# EAGLE schematic mainboard_matrix (EAGLE 9.0.1)
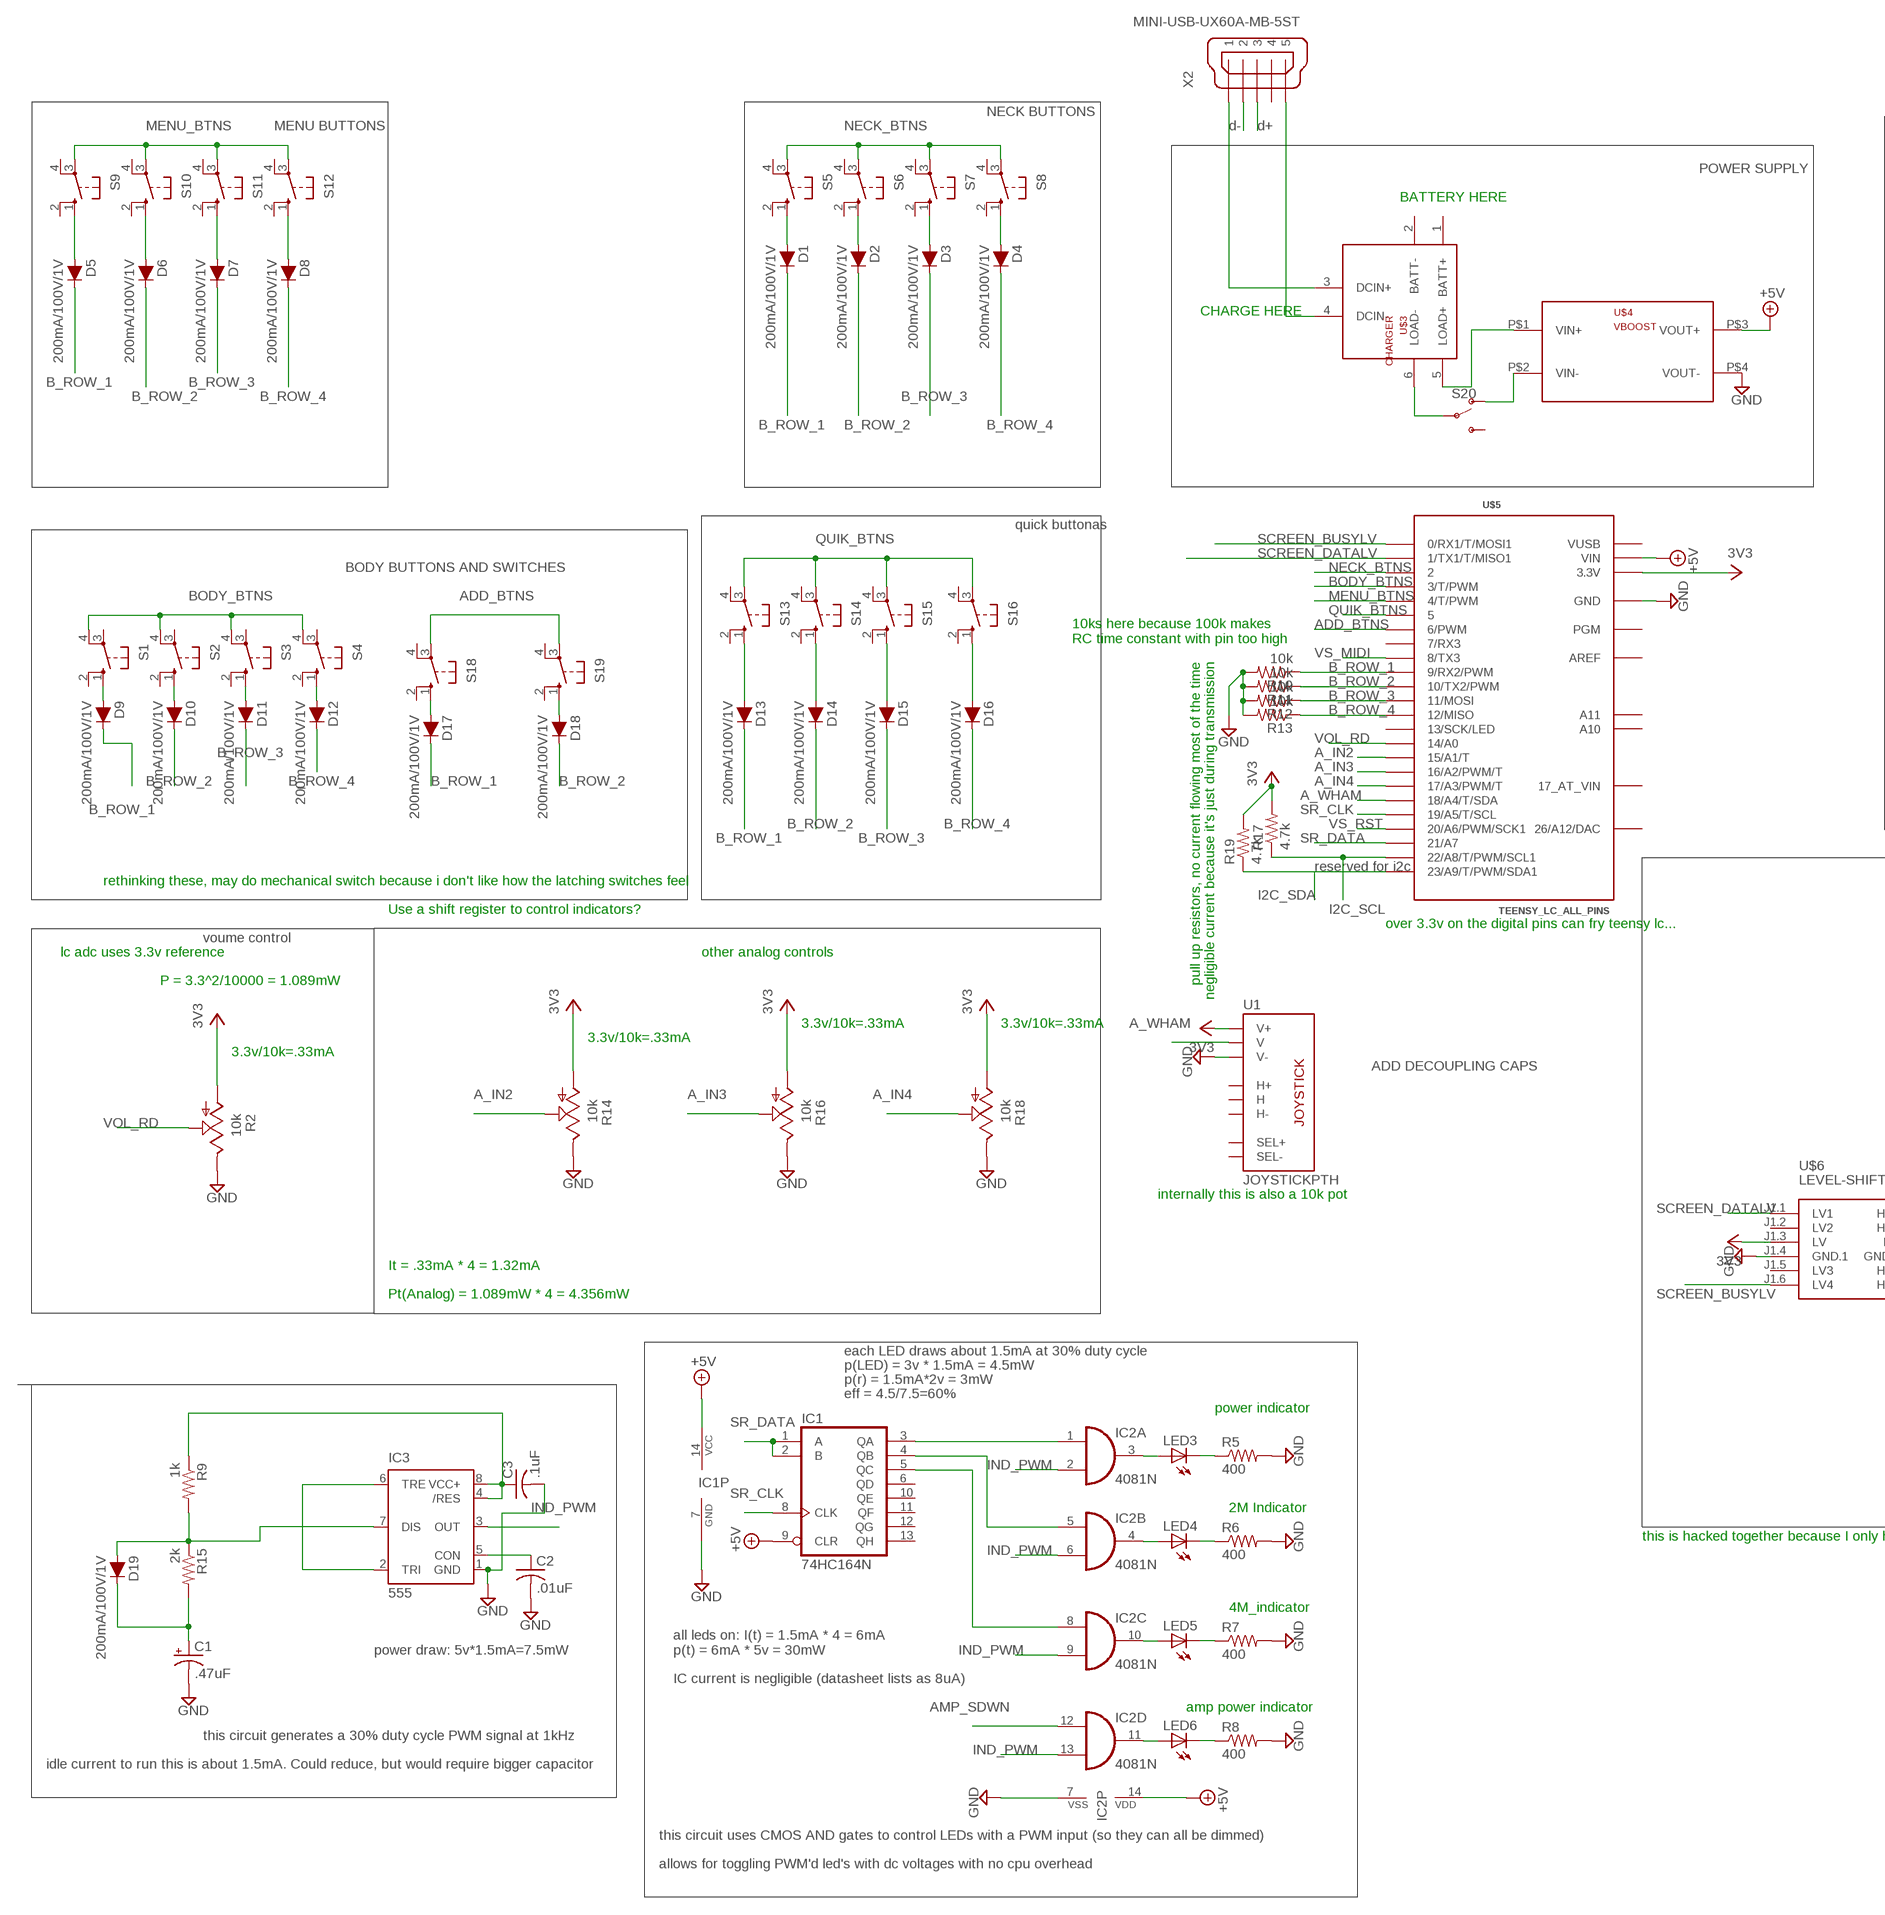
[diagram p0: schematic, sheet 1, part 1 of 2]
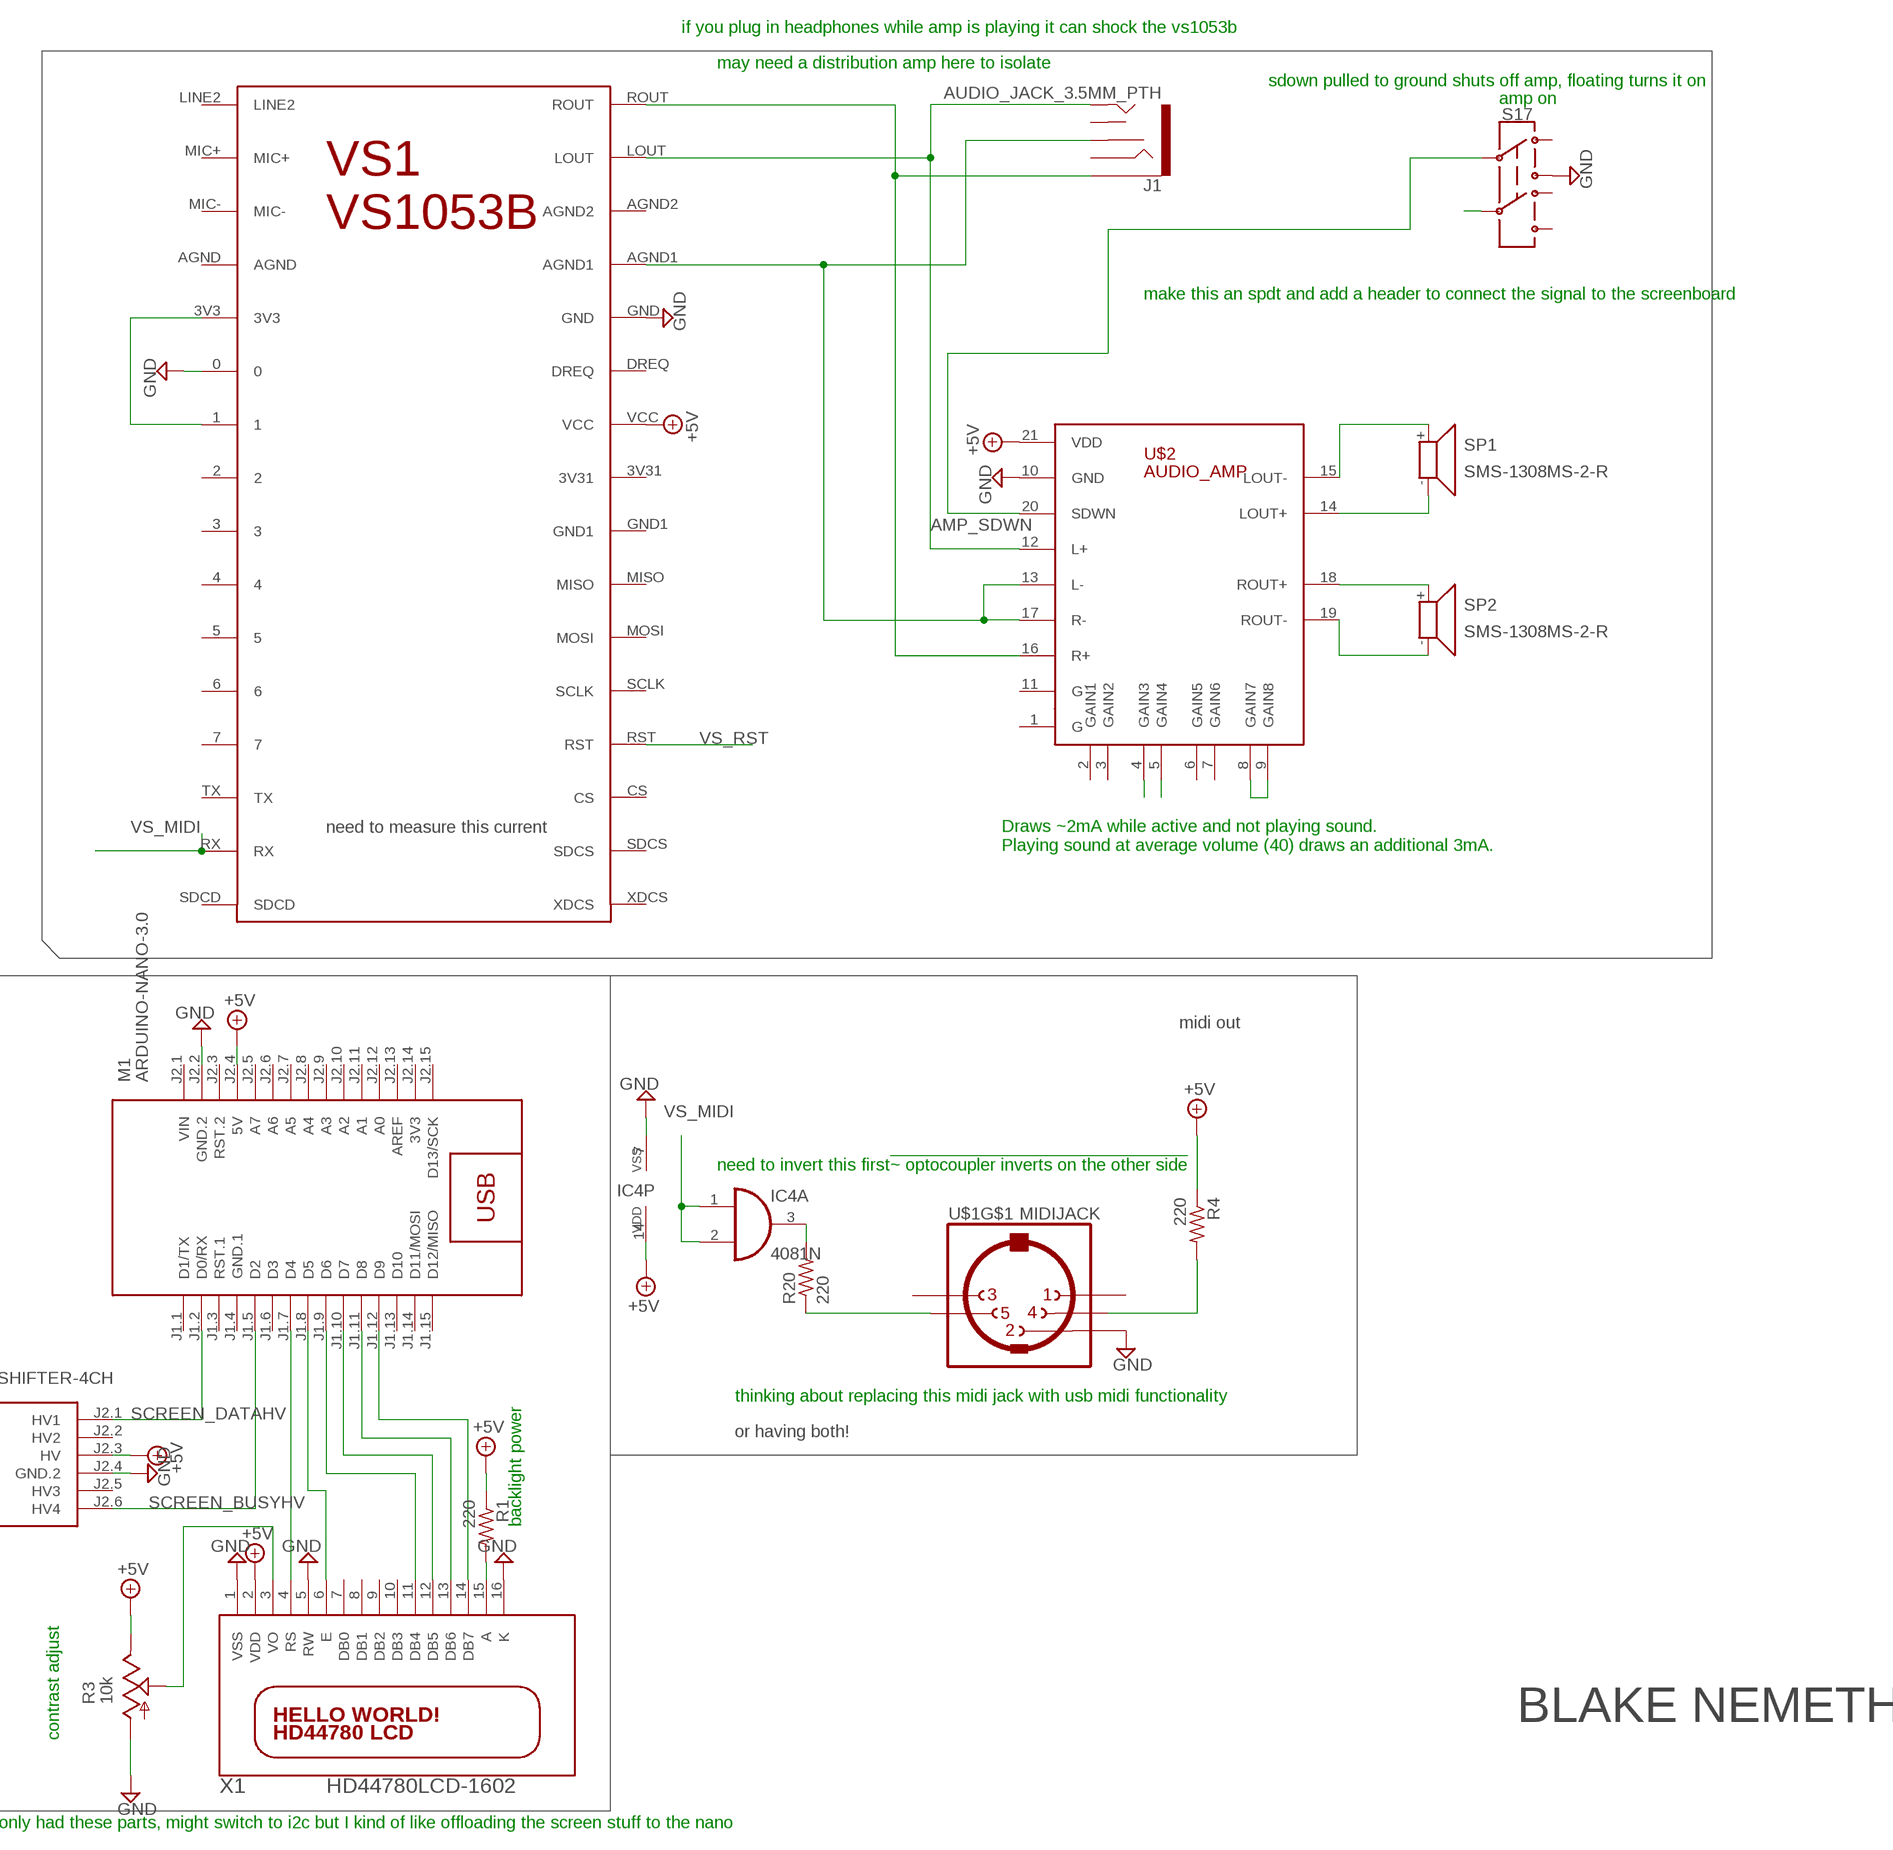
[diagram p1: schematic, sheet 1, part 2 of 2]

## Parts
C1  .47uF  CPOL-USE2-4  [E2-4]
C2  .01uF  C-US025-030X050  [C025-030X050]
C3  .1uF  C-US025-030X050  [C025-030X050]
D1  200mA/100V/1V  DIODE-1N4148  [DIODE-1N4148]
D2  200mA/100V/1V  DIODE-1N4148  [DIODE-1N4148]
D3  200mA/100V/1V  DIODE-1N4148  [DIODE-1N4148]
D4  200mA/100V/1V  DIODE-1N4148  [DIODE-1N4148]
D5  200mA/100V/1V  DIODE-1N4148  [DIODE-1N4148]
D6  200mA/100V/1V  DIODE-1N4148  [DIODE-1N4148]
D7  200mA/100V/1V  DIODE-1N4148  [DIODE-1N4148]
D8  200mA/100V/1V  DIODE-1N4148  [DIODE-1N4148]
D9  200mA/100V/1V  DIODE-1N4148  [DIODE-1N4148]
D10  200mA/100V/1V  DIODE-1N4148  [DIODE-1N4148]
D11  200mA/100V/1V  DIODE-1N4148  [DIODE-1N4148]
D12  200mA/100V/1V  DIODE-1N4148  [DIODE-1N4148]
D13  200mA/100V/1V  DIODE-1N4148  [DIODE-1N4148]
D14  200mA/100V/1V  DIODE-1N4148  [DIODE-1N4148]
D15  200mA/100V/1V  DIODE-1N4148  [DIODE-1N4148]
D16  200mA/100V/1V  DIODE-1N4148  [DIODE-1N4148]
D17  200mA/100V/1V  DIODE-1N4148  [DIODE-1N4148]
D18  200mA/100V/1V  DIODE-1N4148  [DIODE-1N4148]
D19  200mA/100V/1V  DIODE-1N4148  [DIODE-1N4148]
IC1  74HC164N  [DIL14]
IC2  4081N  [DIL14]
IC3  555  555P  [DIP08]
IC4  4081N  [DIL14]
J1  AUDIO_JACK_3.5MM_PTH  [AUDIO-JACK]
LED3  LED5MM  [LED5MM]
LED4  LED5MM  [LED5MM]
LED5  LED5MM  [LED5MM]
LED6  LED5MM  [LED5MM]
M1  ARDUINO-NANO-3.0  [ARDUINO-NANO-3.0]
R1  220  R-US_0204/7  [0204/7]
R2  10k  TRIM_US-B64Y  [B64Y]
R3  10k  TRIM_US-B64Y  [B64Y]
R4  220  R-US_0204/7  [0204/7]
R5  400  R-US_0204/7  [0204/7]
R6  400  R-US_0204/7  [0204/7]
R7  400  R-US_0204/7  [0204/7]
R8  400  R-US_0204/7  [0204/7]
R9  1k  R-US_0204/7  [0204/7]
R10  10k  R-US_0204/7  [0204/7]
R11  10k  R-US_0204/7  [0204/7]
R12  10k  R-US_0204/7  [0204/7]
R13  10k  R-US_0204/7  [0204/7]
R14  10k  TRIM_US-B64Y  [B64Y]
R15  2k  R-US_0204/7  [0204/7]
R16  10k  TRIM_US-B64Y  [B64Y]
R17  4.7k  R-US_0204/7  [0204/7]
R18  10k  TRIM_US-B64Y  [B64Y]
R19  4.7k  R-US_0204/7  [0204/7]
R20  220  R-US_0204/7  [0204/7]
S1  10-XX  [B3F-10XX]
S2  10-XX  [B3F-10XX]
S3  10-XX  [B3F-10XX]
S4  10-XX  [B3F-10XX]
S5  10-XX  [B3F-10XX]
S6  10-XX  [B3F-10XX]
S7  10-XX  [B3F-10XX]
S8  10-XX  [B3F-10XX]
S9  10-XX  [B3F-10XX]
S10  10-XX  [B3F-10XX]
S11  10-XX  [B3F-10XX]
S12  10-XX  [B3F-10XX]
S13  10-XX  [B3F-10XX]
S14  10-XX  [B3F-10XX]
S15  10-XX  [B3F-10XX]
S16  10-XX  [B3F-10XX]
S17  SWITCH-DPDT-PTH-GPI-152-3013  [SWITCH_DPDT_PTH_GPI-152-3013]
S18  10-XX  [B3F-10XX]
S19  10-XX  [B3F-10XX]
S20  SWITCH-SPDT-PTH-11.6X4.0MM  [SWITCH_SPDT_PTH_11.6X4.0MM]
SP1  SMS-1308MS-2-R  [SMS-1308MS-2-R]
SP2  SMS-1308MS-2-R  [SMS-1308MS-2-R]
U1  JOYSTICKPTH  [JOYSTICK]
U$1  MIDIJACK  [CP-2350]
U$2  AUDIO_AMP  [AUDIO_AMP]
U$3  CHARGER  [CHARGER]
U$4  VBOOST  [VBOOST]
U$5  TEENSY_LC_ALL_PINS  [TEENSY_3.0-3.2&LC_ALL_PINS]
U$6  LEVEL-SHIFTER-4CH  [LEVEL-SHIFTER-4CH]
VS1  VS1053B  [VS1053B]
X1  HD44780LCD-1602  [LCD1602]
X2  MINI-USB-UX60A-MB-5ST  [UX60A-MB-5ST]

## Nets
+5V: IC1.9(CLR) IC1.14(VCC) IC2.14(P:VDD) IC4.14(P:VDD) M1.J2.4(5V) R1.1 R3.E R4.1 U$2.21(VDD) U$4.P$3(VOUT+) U$5.VIN U$6.J2.3(HV) VS1.VCC X1.2(VDD)
A_IN2: R14.S U$5.15/A1(15/A1/T)
A_IN3: R16.S U$5.16/A2(16/A2/PWM/T)
A_IN4: R18.S U$5.17/A3(17/A3/PWM/T)
A_WHAM: U1.V2(V) U$5.18/A4(18/A4/T/SDA)
ADD_BTNS: S18.3(P) S19.3(P) U$5.6(6/PWM)
AMP_SDWN: IC2.12(D:I0) S17.C@1 U$2.20(SDWN)
B_ROW_1: D1.C D5.C D9.C D13.C D17.C R10.1 U$5.9(9/RX2/PWM)
B_ROW_2: D2.C D6.C D10.C D14.C D18.C R11.1 U$5.10(10/TX2/PWM)
B_ROW_3: D3.C D7.C D11.C D15.C R12.1 U$5.11(11/MOSI)
B_ROW_4: D4.C D8.C D12.C D16.C R13.1 U$5.12(12/MISO)
BODY_BTNS: S1.4(P1) S2.4(P1) S3.4(P1) S4.4(P1) U$5.3(3/T/PWM)
GND: C1.- C2.2 C3.2 IC1.7(GND) IC2.7(P:VSS) IC3.1(GND) IC4.7(P:VSS) M1.J2.2(GND.2) R2.E R3.A R5.2 R6.2 R7.2 R8.2 R10.2 R11.2 R12.2 R13.2 R14.E R16.E R18.E S17.20 U1.V3(V-) U$1.2 U$2.10(GND) U$4.P$4(VOUT-) U$5.AGND(GND) U$5.GND U$5.GND1(GND) U$6.J1.4(GND.1) U$6.J2.4(GND.2) VS1.0 VS1.GND X1.1(VSS) X1.5(RW) X1.16(K)
I2C_SCL: R17.1 U$5.22/A8(22/A8/T/PWM/SCL1)
I2C_SDA: R19.1 U$5.23/A9(23/A9/T/PWM/SDA1)
IND_PWM: IC2.2(A:I1) IC2.6(B:I1) IC2.9(C:I1) IC2.13(D:I1) IC3.3(OUT)
MENU_BTNS: S9.3(P) S10.3(P) S11.3(P) S12.3(P) U$5.4(4/T/PWM)
N$1: M1.J1.7(D4) X1.4(RS)
N$2: X2.2
N$3: X2.3
N$4: U$3.3(DCIN+) X2.1
N$5: U$3.4(DCIN-) X2.5
N$6: D17.A S18.1(S)
N$7: D18.A S19.1(S)
N$8: S20.1(O) U$4.P$2(VIN-)
N$9: S17.C@2
N$11: R20.2
N$12: U$3.5(LOAD+) U$4.P$1(VIN+)
N$13: D1.A S5.1(S)
N$14: IC1.3(QA) IC2.1(A:I0)
N$15: S20.2(P) U$3.6(LOAD-)
N$16: M1.J1.8(D5) X1.6(E)
N$17: IC1.4(QB) IC2.5(B:I0)
N$18: U$2.4(GAIN3)
N$19: M1.J1.9(D6) X1.11(DB4)
N$20: D2.A S6.1(S)
N$21: D3.A S7.1(S)
N$22: VS1.1 VS1.3V3
N$23: D4.A S8.1(S)
N$24: D5.A S9.1(S)
N$25: J1.TIP U$2.12(L+) VS1.LOUT
N$26: J1.SLEEVE U$2.16(R+) VS1.ROUT
N$27: SP2.+ U$2.18(ROUT+)
N$28: SP2.- U$2.19(ROUT-)
N$29: SP1.- U$2.14(LOUT+)
N$30: SP1.+ U$2.15(LOUT-)
N$31: D6.A S10.1(S)
N$32: J1.RSH U$2.13(L-) U$2.17(R-) VS1.AGND1
N$33: D7.A S11.1(S)
N$34: D8.A S12.1(S)
N$35: D9.A S1.1(S)
N$36: U$2.5(GAIN4)
N$37: D10.A S2.1(S)
N$38: D11.A S3.1(S)
N$39: D12.A S4.1(S)
N$40: U$2.8(GAIN7) U$2.9(GAIN8)
N$41: D13.A S13.1(S)
N$42: D14.A S14.1(S)
N$43: D15.A S15.1(S)
N$44: D16.A S16.1(S)
N$45: R4.2 U$1.4
N$46: R20.1 U$1.5
N$47: IC2.3(A:O) LED3.A
N$48: M1.J1.10(D7) X1.12(DB5)
N$49: IC1.5(QC) IC2.8(C:I0)
N$50: LED3.K(C) R5.1
N$51: IC2.4(B:O) LED4.A
N$52: M1.J1.11(D8) X1.13(DB6)
N$53: M1.J1.12(D9) X1.14(DB7)
N$54: LED4.K(C) R6.1
N$55: IC2.10(C:O) LED5.A
N$56: LED5.K(C) R7.1
N$57: IC2.11(D:O) LED6.A
N$58: LED6.K(C) R8.1
N$59: IC3.2(TRI) IC3.6(TRE)
N$60: D19.A IC3.7(DIS) R9.2 R15.1
N$61: C2.1 IC3.5(CON)
N$62: C1.+ D19.C R15.2
N$63: R1.2 X1.15(A)
N$64: R3.S X1.3(VO)
N$65: C3.1 IC3.4(/RES) IC3.8(VCC+) R9.1
NECK_BTNS: S5.3(P) S6.3(P) S7.3(P) S8.3(P) U$5.2
QUIK_BTNS: S13.3(P) S14.3(P) S15.3(P) S16.3(P) U$5.5
SCREEN_BUSYHV: M1.J1.5(D2) U$6.J2.6(HV4)
SCREEN_BUSYLV: U$5.0(0/RX1/T/MOSI1) U$6.J1.6(LV4)
SCREEN_DATAHV: M1.J1.2(D0/RX) U$6.J2.1(HV1)
SCREEN_DATALV: U$5.1(1/TX1/T/MISO1) U$6.J1.1(LV1)
SR_CLK: IC1.8(CLK) U$5.19/A5(19/A5/T/SCL)
SR_DATA: IC1.1(A) IC1.2(B) U$5.21/A7
VCC: R2.A R14.A R16.A R17.2 R18.A R19.2 U1.V1(V+) U$5.3.3V U$5.3.3V1(3.3V) U$6.J1.3(LV) ; supply symbol labelled 3V3
VOL_RD: R2.S U$5.14/A0
VS_MIDI: IC4.1(A:I0) IC4.2(A:I1) U$5.8(8/TX3) VS1.RX
VS_RST: U$5.20/A6(20/A6/PWM/SCK1) VS1.RST
Unconnected: IC1.6(QD) IC1.10(QE) IC1.11(QF) IC1.12(QG) IC1.13(QH) IC4.3(A:O) IC4.4(B:O) IC4.5(B:I0) IC4.6(B:I1) IC4.8(C:I0) IC4.9(C:I1) IC4.10(C:O) IC4.11(D:O) IC4.12(D:I0) IC4.13(D:I1) J1.RING J1.TSH M1.J1.1(D1/TX) M1.J1.3(RST.1) M1.J1.6(D3) M1.J1.13(D10) M1.J1.14(D11/MOSI) M1.J1.15(D12/MISO) M1.J2.3(RST.2) M1.J2.5(A7) M1.J2.6(A6) M1.J2.7(A5) M1.J2.8(A4) M1.J2.9(A3) M1.J2.10(A2) M1.J2.11(A1) M1.J2.12(A0) M1.J2.13(AREF) M1.J2.15(D13/SCK) S1.2(S1) S1.3(P) S2.2(S1) S2.3(P) S3.2(S1) S3.3(P) S4.2(S1) S4.3(P) S5.2(S1) S5.4(P1) S6.2(S1) S6.4(P1) S7.2(S1) S7.4(P1) S8.2(S1) S8.4(P1) S9.2(S1) S9.4(P1) S10.2(S1) S10.4(P1) S11.2(S1) S11.4(P1) S12.2(S1) S12.4(P1) S13.2(S1) S13.4(P1) S14.2(S1) S14.4(P1) S15.2(S1) S15.4(P1) S16.2(S1) S16.4(P1) S17.10 S17.11 S17.21 S18.2(S1) S18.4(P1) S19.2(S1) S19.4(P1) S20.3(S) U1.B1A(SEL+) U1.B2A(SEL-) U1.H1(H+) U1.H2(H) U1.H3(H-) U$1.1 U$1.3 U$1.PE1(MT) U$1.PE2(MT) U$1.PE(MT) U$1.PE@(MT) U$2.1(G) U$2.2(GAIN1) U$2.3(GAIN2) U$2.6(GAIN5) U$2.7(GAIN6) U$2.11(G`) U$3.1(BATT+) U$3.2(BATT-) U$5.7(7/RX3) U$5.13(13/SCK/LED) U$5.A10 U$5.A11 U$5.PGM U$5.VBAT(17_AT_VIN) U$6.J1.2(LV2) U$6.J1.5(LV3) U$6.J2.2(HV2) U$6.J2.5(HV3) VS1.2 VS1.3 VS1.3V31 VS1.4 VS1.5 VS1.6 VS1.7 VS1.AGND VS1.AGND2 VS1.CS VS1.DREQ VS1.GND1 VS1.LINE2 VS1.MIC+ VS1.MIC- VS1.MISO VS1.MOSI VS1.SCLK VS1.SDCD VS1.SDCS VS1.TX VS1.XDCS X1.7(DB0) X1.8(DB1) X1.9(DB2) X1.10(DB3) X2.4

## Notes on the sheet
- if you plug in headphones while amp is playing it can shock the vs1053b
- NECK BUTTONS
- MENU BUTTONS | d- | d+ | may need a distribution amp here to isolate
- sdown pulled to ground shuts off amp, floating turns it on
- amp on
- POWER SUPPLY
- BATTERY HERE
- CHARGE HERE | make this an spdt and add a header to connect the signal to the screenboard
- quick buttonas
- BODY BUTTONS AND SWITCHES
- 10ks here because 100k makes 
  RC time constant with pin too high
- need to measure this current
- Draws ~2mA while active and not playing sound.
  Playing sound at average volume (40) draws an additional 3mA.
- reserved for i2c
- rethinking these, may do mechanical switch because i don't like how the latching switches feel
- midi out
- Use a shift register to control indicators?
- over 3.3v on the digital pins can fry teensy lc...
- voume control
- lc adc uses 3.3v reference | other analog controls
- P = 3.3^2/10000 = 1.089mW | pull up resistors, no current flowing most of the time
- negligible current because it's just during transmission
- need to invert this first!~ optocoupler inverts on the other side
- 3.3v/10k=.33mA | 3.3v/10k=.33mA
- 3.3v/10k=.33mA
- 3.3v/10k=.33mA
- ADD DECOUPLING CAPS
- internally this is also a 10k pot | thinking about replacing this midi jack with usb midi functionality
- or having both!
- It = .33mA * 4 = 1.32mA
- Pt(Analog) = 1.089mW * 4 = 4.356mW | backlight power
- each LED draws about 1.5mA at 30% duty cycle
- p(LED) = 3v * 1.5mA = 4.5mW
- p(r) = 1.5mA*2v = 3mW
- eff = 4.5/7.5=60%
- power indicator
- BLAKE NEMETH
- contrast adjust
- 2M Indicator
- this is hacked together because I only had these parts, might switch to i2c but I kind of like offloading the screen stuff to the nano
- 4M_indicator
- power draw: 5v*1.5mA=7.5mW
- all leds on: I(t) = 1.5mA * 4 = 6mA
  p(t) = 6mA * 5v = 30mW
- IC current is negligible (datasheet lists as 8uA)
- amp power indicator
- this circuit generates a 30% duty cycle PWM signal at 1kHz
- idle current to run this is about 1.5mA. Could reduce, but would require bigger capacitor
- this circuit uses CMOS AND gates to control LEDs with a PWM input (so they can all be dimmed)
- allows for toggling PWM'd led's with dc voltages with no cpu overhead

## Power pins joined to a net without a drawn wire
3V3: M1.J2.14(3V3)
26/A12/DAC: U$5.RESET/DAC(26/A12/DAC)
AREF: U$5.AREF
GND.1: M1.J1.4(GND.1)
VIN: M1.J2.1(VIN)
VUSB: U$5.VUSB

## Library data of the parts
C1 = rcl:CPOL-US: POLARIZED CAPACITOR, American symbol; SPICEPREFIX: C
C2 C3 = rcl:C-US: CAPACITOR, American symbol; SPICEPREFIX: C
D1-D19 = SparkFun-DiscreteSemi:DIODE: Diode These are standard reverse protection diodes and small signal diodes. SparkFun Products: SparkFun SparkPunk Sound Kit <https://www.sparkfun.com/products/11177> SparkFun ESP8266 Thing <https://www.sparkfun.com/products/13231>; PROD_ID: DIO-08378
IC1 = 74xx-us:74*164: 8-bit parallel out SHIFT REGISTER
IC2 IC4 = 40xx:4081: Quad 2-input AND
IC3 = SparkFun-IC-Special-Function:555: General purpose bipolar Timer Datasheet <http://www.sparkfun.com/datasheets/Components/General/ne555.pdf> SparkFun Products SparkFun SparkPunk Sequencer Kit <https://www.sparkfun.com/products/12707> (KIT-12707) Storefront Component: 555 Timer <https://www.sparkfun.com/products/9273> (COM-09273) Two parts valid for production: VFP: IC-11930 (M7555 PTH) VFP: IC-09173 (555 PTH) - Preferred; PROD_ID: IC-09173; PROD_ID_ALT: IC-09173
J1 = SparkFun-Connectors:AUDIO_JACK_3.5MM: Audio Jack 3.5mm variants of PTH and SMT stereo audio jack with bypass switches. SparkFun Products: SparkFun SparkPunk Sound Kit <[https://www.sparkfun.com/products/11177]> - PTH MP3 Trigger <https://www.sparkfun.com/products/13720> -3.5mm SMD SparkFun PicoBoard <https://www.sparkfun.com/products/11888>- 2.5mm SMD; PROD_ID: CONN-08774; SF_ID: PRT-08032
LED3-LED6 = led:LED: LED OSRAM: - CHIPLED LG R971, LG N971, LY N971, LG Q971, LY Q971, LO R971, LY R971 LH N974, LH R974 LS Q976, LO Q976, LY Q976 LO Q996 - Hyper CHIPLED LW Q18S LB Q993, LB Q99A, LB R99A - SideLED LS A670, LO A670, LY A670, LG A670, LP A670 LB A673, LV A673, LT A673, LW A673 LH A674 LY A675 LS A676, LA A676, LO A676, LY A676, LW A676 LS A679, LY A679, LG A679 - Hyper Micro SIDELED® LS Y876, LA Y876, LO Y876, LY Y876 LT Y87S - SmartLED LW L88C, LW L88S LB L89C, LB L89S, LG L890 LS L89K, LO L89K, LY L89K LS L896, LA L896, LO L896, LY L896 - TOPLED LS T670, LO T670, LY T670, LG T670, LP T670 LSG T670, LSP T670, LSY T670, LOP T670, LYG T670 LG T671, LOG T671, LSG T671 LB T673, LV T673, LT T673, LW T673 LH T674 LS T676, LA T676, LO T676, LY T676, LB T676, LH T676, LSB T676, LW T676 LB T67C, LV T67C, LT T67C, LS T67K, LO T67K, LY T67K, LW E67C LS E67B, LA E67B, LO E67B, LY E67B, LB E67C, LV E67C, LT E67C LW T67C LS T679, LY T679, LG T679 LS T770, LO T770, LY T770, LG T770, LP T770 LB T773, LV T773, LT T773, LW T773 LH T774 LS E675, LA E675, LY E675, LS T675 LS T776, LA T776, LO T776, LY T776, LB T776 LHGB T686 LT T68C, LB T68C - Hyper Mini TOPLED® LB M676 - Mini TOPLED Santana® LG M470 LS M47K, LO M47K, LY M47K Source: http://www.osram.convergy.de LUXEON: - LUMILED® LXK2-PW12-R00, LXK2-PW12-S00, LXK2-PW14-U00, LXK2-PW14-V00 LXK2-PM12-R00, LXK2-PM12-S00, LXK2-PM14-U00 LXK2-PE12-Q00, LXK2-PE12-R00, LXK2-PE12-S00, LXK2-PE14-T00, LXK2-PE14-U00 LXK2-PB12-K00, LXK2-PB12-L00, LXK2-PB12-M00, LXK2-PB14-N00, LXK2-PB14-P00, LXK2-PB14-Q00 LXK2-PR12-L00, LXK2-PR12-M00, LXK2-PR14-Q00, LXK2-PR14-R00 LXK2-PD12-Q00, LXK2-PD12-R00, LXK2-PD12-S00 LXK2-PH12-R00, LXK2-PH12-S00 LXK2-PL12-P00, LXK2-PL12-Q00, LXK2-PL12-R00 Source: www.luxeon.com KINGBRIGHT: KA-3528ASYC Source: www.kingbright.com
M1 = diy-modules:ARDUINO-NANO-3.0: Arduino Nano 3.0 and compatible devices More details available here: https://www.arduino.cc/en/Main/ArduinoBoardNano Click here to find device on ebay.com <http://www.ebay.com/sch/arduino+nano>
R1 R4-R13 R15 R17 R19 R20 = rcl:R-US_: RESISTOR, American symbol; SPICEPREFIX: R
R2 R3 R14 R16 R18 = pot:TRIM_US-: POTENTIOMETER
S1-S16 S18 S19 = switch-omron:10-XX: OMRON SWITCH; MPN: B3F-1000; OC_FARNELL: 176432; OC_NEWARK: 36M3542
S17 = SparkFun-Switches:SWITCH-DPDT: Double-Pole, Double-Throw (DPDT) Switch Double-pole, double-throw switches. Variant Overview PTH-GPI-152-3013 Used on SparkFun Geiger Counter <https://www.sparkfun.com/products/11345> SMD-AY0202 Surface Mount DPDT Switch <https://www.sparkfun.com/products/597> (COM-00597) Used on e.g. LilyPad Arduino USB - ATmega32U4 Board <https://www.sparkfun.com/products/12049>; PROD_ID: SWCH-10554
S20 = SparkFun-Switches:SWITCH-SPDT: Single Pole, Double Throw (SPDT) Switch Single-pole, double-throw (SPDT) switch. Variant Overview SMD-AYZ0202 Surface Mount DPDT Switch <https://www.sparkfun.com/products/597> (COM-00597) Used on e.g. LilyPad Arduino USB - ATmega32U4 Board <https://www.sparkfun.com/products/12049> PTH-11.6X4.0MM SPDT Mini Power Switch <https://www.sparkfun.com/products/102> (COM-00102) Used on e.g. SparkFun Simon Says - Through-Hole Soldering Kit <https://www.sparkfun.com/products/10547> (KIT-10547) PTH-11.6X4.0MM-KIT KIT version of SPDT Mini Power Switch - Simplifies soldering by removing tStop of switch pins - only one side can be soldered. PTH-11.6X4.0MM-LOCK LOCK version of SPDT Mini Power Switch - Offset pins hold switch in place for easier soldering. SMD-RIGHT-ANGLE Surface Mount Right Angle Switch <https://www.sparkfun.com/products/10860> (COM-10860) Used on e.g. SparkFun ESP8266 Thing <https://www.sparkfun.com/products/13231>; PROD_ID: SWCH-08261; SF_SKU: COM-00102
SP1 SP2 = speaker:SMS-1308MS-2-R: Speaker 13 x 13mm, 8 Ohm, 0.7W Source: pui audio inc. SMS-1308MS-2-R.pdf
U1 = adafruit:JOYSTICK: Thumb Joystick Joystick commonly found in PS2 controllers. Two pots and a select switch. Adapted from Sparkfun Library (but for more common 6mm switch sticks)
U$1 = adafruit:MIDIJACK: DIN 5 jack also known as MIDI jack A modification of conn-hirshman:MAB5SH with two options for the grounding 'teeth'
U$2 = synthtar:AUDIO_AMP
U$3 = synthtar:CHARGER
U$4 = synthtar:VBOOST
U$5 = Teensy_3_and_LC_Series_Boards_v1.4:TEENSY_LC_ALL_PINS: Teensy LC board with all pins used.
U$6 = diy-modules:LEVEL-SHIFTER-4CH: 4-Channel Bi-Directional Logic Level Converter based on BSS128 transistors Click here to find device on ebay.com <http://www.ebay.com/sch/i2c+logic+converter+module>
VS1 = synthtar:VS1053B
X1 = adafruit:HD44780LCD: HD44780 LCD Standard character type LCDs, available in sizes from 8x1 to 40x4!
X2 = con-hirose:MINI-USB-: MINI USB Connector Source: http://www.hirose.co.jp/cataloge_hp/e24000019.pdf; OC_FARNELL: unknown; OC_NEWARK: unknown